# Altium project Multislope.PrjPcb (part 1 of 2)
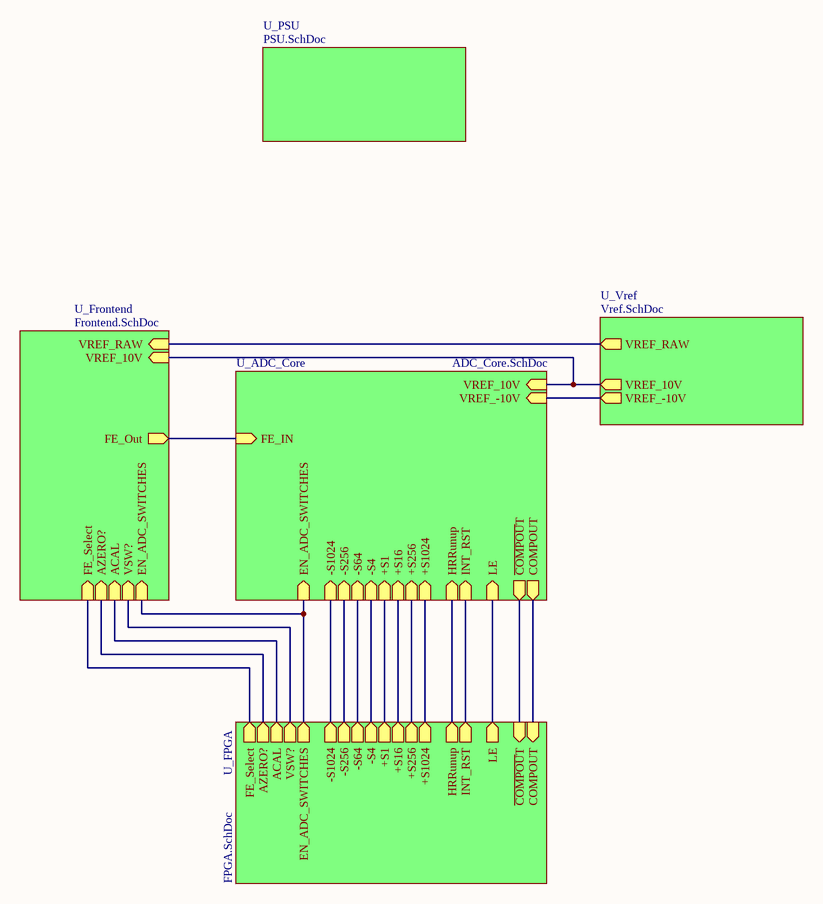
[diagram p0: Block_Diagram.SchDoc]
6 sheets, 139 parts. Net scope: hierarchical (ports join the sheet entries above them; power ports are global).
Board files: Multislope_Board.PcbDoc, MacLayout.PcbDoc, Copy of MacLayout.PcbDoc
Sheets:
  Block_Diagram.SchDoc
    U_ADC_Core = ADC_Core.SchDoc
    U_Vref = Vref.SchDoc
    U_Frontend = Frontend.SchDoc
    U_FPGA = FPGA.SchDoc
    U_PSU = PSU.SchDoc

## Sheet Block_Diagram.SchDoc
size A3

### Sub-sheets
U_ADC_Core = ADC_Core.SchDoc: FE_IN (in), -S64 (in), -S1024 (in), COMPOUT (out), +S16 (in), +S1024 (in), +S256 (in), LE (in), -S4 (in), INT_RST (in), ~{COMPOU}T (out), -S256 (in), HRRunup (in), +S1 (in), VREF_10V (in), VREF_-10V (in), EN_ADC_SWITCHES (in)
U_FPGA = FPGA.SchDoc: COMPOUT (in), ~{COMPOU}T (in), LE (out), INT_RST (out), HRRunup (out), +S1024 (out), +S256 (out), +S16 (out), +S1 (out), -S4 (out), -S64 (out), -S256 (out), -S1024 (out), EN_ADC_SWITCHES (out), VSW? (out), ACAL (out), AZERO? (out), FE_Select (out)
U_Frontend = Frontend.SchDoc: FE_Out (out), VREF_10V (in), VSW? (in), FE_Select (in), AZERO? (in), ACAL (in), VREF_RAW (in), EN_ADC_SWITCHES (in)
U_PSU = PSU.SchDoc: no entries
U_Vref = Vref.SchDoc: VREF_10V (out), VREF_-10V (out), VREF_RAW (out)

### Nets
SW_ENABLE: sheet U_ADC_Core/EN_ADC_SWITCHES, sheet U_Frontend/EN_ADC_SWITCHES, sheet U_FPGA/EN_ADC_SWITCHES
NetB1_CB_2: sheet U_ADC_Core/+S1024, sheet U_FPGA/+S1024
NetB1_CB_3: sheet U_ADC_Core/+S256, sheet U_FPGA/+S256
NetB1_CB_5: sheet U_ADC_Core/+S16, sheet U_FPGA/+S16
NetB1_CB_6: sheet U_ADC_Core/+S1, sheet U_FPGA/+S1
NetB1_CB_8: sheet U_ADC_Core/-S4, sheet U_FPGA/-S4
NetB1_CB_9: sheet U_ADC_Core/-S64, sheet U_FPGA/-S64
NetB1_CB_11: sheet U_ADC_Core/-S256, sheet U_FPGA/-S256
NetB1_CB_12: sheet U_ADC_Core/-S1024, sheet U_FPGA/-S1024
NetB1_CB_15: sheet U_Frontend/AZERO?, sheet U_FPGA/AZERO?
NetB1_CB_17: sheet U_Frontend/FE_Select, sheet U_FPGA/FE_Select
NetB1_CB_18: sheet U_ADC_Core/LE, sheet U_FPGA/LE
NetB1_CB_20: sheet U_Frontend/ACAL, sheet U_FPGA/ACAL
NetB1_CB_21: sheet U_Frontend/VSW?, sheet U_FPGA/VSW?
NetB1_CB_45: sheet U_ADC_Core/~{COMPOU}T, sheet U_FPGA/~{COMPOU}T
NetB1_CB_46: sheet U_ADC_Core/COMPOUT, sheet U_FPGA/COMPOUT
NetB1_CB_48: sheet U_ADC_Core/HRRunup, sheet U_FPGA/HRRunup
NetB1_CB_49: sheet U_ADC_Core/INT_RST, sheet U_FPGA/INT_RST
NetIC1_8: sheet U_ADC_Core/FE_IN, sheet U_Frontend/FE_Out
NetIC2_5: sheet U_Vref/VREF_RAW, sheet U_Frontend/VREF_RAW
NetL1_2: sheet U_ADC_Core/VREF_10V, sheet U_Vref/VREF_10V, sheet U_Frontend/VREF_10V
NetL3_1: sheet U_ADC_Core/VREF_-10V, sheet U_Vref/VREF_-10V

## Sheet ADC_Core.SchDoc
size A2
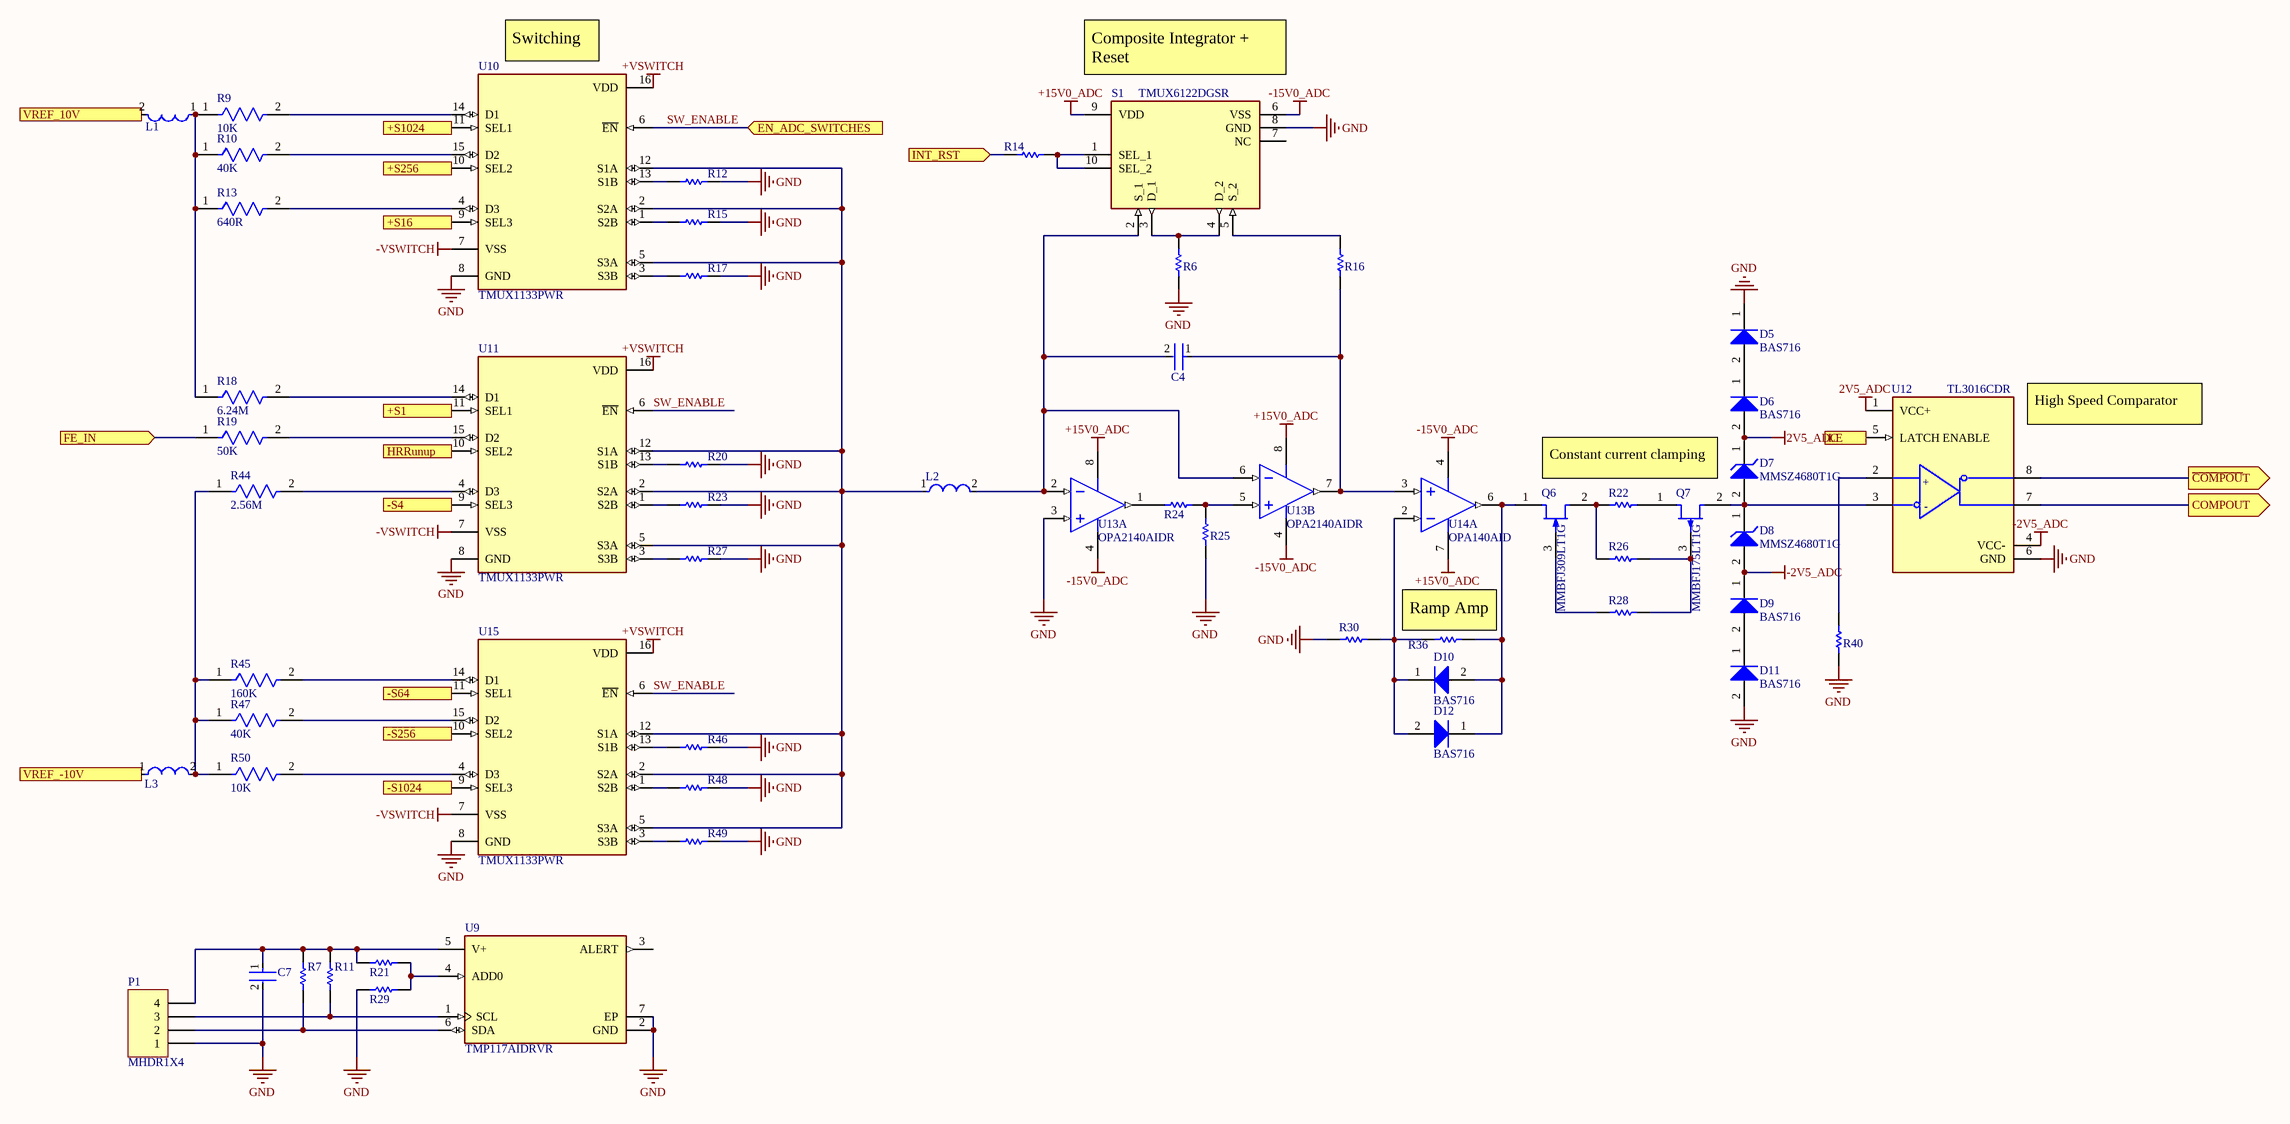
[diagram p1: ADC_Core.SchDoc]

### Parts
C4  C1206C331J5GACTU  [FP-C1206C-EB-MFG]  (value not drawn)
C7  C0402C104K8PACTU  [FP-C0402-BB-MFG]  (value not drawn)
D5  BAS716  [ONSC-SOD-523-2-502-01_V]
D6  BAS716  [ONSC-SOD-523-2-502-01_V]
D7  MMSZ4680T1G  [ONSC-SOD-123-2-425-04_V]
D8  MMSZ4680T1G  [ONSC-SOD-123-2-425-04_V]
D9  BAS716  [ONSC-SOD-523-2-502-01_V]
D10  BAS716  [ONSC-SOD-523-2-502-01_V]
D11  BAS716  [ONSC-SOD-523-2-502-01_V]
D12  BAS716  [ONSC-SOD-523-2-502-01_V]
L1  LQW15ANR10J00D  [FP-LQW15AN_00-W0_5-0_1-MFG]  (value not drawn)
L2  LQW15ANR10J00D  [FP-LQW15AN_00-W0_5-0_1-MFG]  (value not drawn)
L3  LQW15ANR10J00D  [FP-LQW15AN_00-W0_5-0_1-MFG]  (value not drawn)
P1  MHDR1X4  [MHDR1X4]
Q6  MMBFJ309LT1G  [ONSC-SOT-23-3-318-08_V]
Q7  MMBFJ175LT1G  [ONSC-SOT-23-3-318-08_V]
R6  ERJ-3GEYJ202V  [RESC1608X55X30ML15T15]  (value not drawn)
R7  CRCW04021K20FKED  [RESC1005X40X25NL05T05]  (value not drawn)
R9  10K  [FP-RC1206-MFG]
R10  40K  [FP-RC1206-MFG]
R11  CRCW04021K20FKED  [RESC1005X40X25NL05T05]  (value not drawn)
R12  ERJ-3GEYJ202V  [RESC1608X55X30ML15T15]  (value not drawn)
R13  640R  [FP-RC1206-MFG]
R14  ERJ-3GEYJ202V  [RESC1608X55X30ML15T15]  (value not drawn)
R15  ERJ-3GEYJ202V  [RESC1608X55X30ML15T15]  (value not drawn)
R16  ERJ-3GEYJ202V  [RESC1608X55X30ML15T15]  (value not drawn)
R17  ERJ-3GEYJ202V  [RESC1608X55X30ML15T15]  (value not drawn)
R18  6.24M  [FP-RC1206-MFG]
R19  50K  [FP-RC1206-MFG]
R20  ERJ-3GEYJ202V  [RESC1608X55X30ML15T15]  (value not drawn)
R21  CRCW04021K20FKED  [RESC1005X40X25NL05T05]  (value not drawn)
R22  ERJ-3GEYJ202V  [RESC1608X55X30ML15T15]  (value not drawn)
R23  ERJ-3GEYJ202V  [RESC1608X55X30ML15T15]  (value not drawn)
R24  ERJ-3GEYJ202V  [RESC1608X55X30ML15T15]  (value not drawn)
R25  ERJ-3GEYJ202V  [RESC1608X55X30ML15T15]  (value not drawn)
R26  ERJ-3EKF4220V  [RESC1608X55X30ML15T15]  (value not drawn)
R27  ERJ-3GEYJ202V  [RESC1608X55X30ML15T15]  (value not drawn)
R28  ERJ-3GEYJ202V  [RESC1608X55X30ML15T15]  (value not drawn)
R29  CRCW04021K20FKED  [RESC1005X40X25NL05T05]  (value not drawn)
R30  ERJ-3GEYJ202V  [RESC1608X55X30ML15T15]  (value not drawn)
R36  ERJ-3GEYJ202V  [RESC1608X55X30ML15T15]  (value not drawn)
R40  ERJ-3GEYJ202V  [RESC1608X55X30ML15T15]  (value not drawn)
R44  2.56M  [FP-RC1206-MFG]
R45  160K  [FP-RC1206-MFG]
R46  ERJ-3GEYJ202V  [RESC1608X55X30ML15T15]  (value not drawn)
R47  40K  [FP-RC1206-MFG]
R48  ERJ-3GEYJ202V  [RESC1608X55X30ML15T15]  (value not drawn)
R49  ERJ-3GEYJ202V  [RESC1608X55X30ML15T15]  (value not drawn)
R50  10K  [FP-RC1206-MFG]
S1  TMUX6122DGSR  [SOP50P490X110-10N]
U9  TMP117AIDRVR  [FP-DRV0006A-MFG]
U10  TMUX1133PWR  [FP-PW0016A-MFG]
U11  TMUX1133PWR  [FP-PW0016A-MFG]
U12  TL3016CDR  [FP-D0008A-IPC_A]
U13  OPA2140AIDR  [D0008A_M]  (parts A,B of 2)
U14  OPA140AID  [D0008A_M]  (part A of 2)
U15  TMUX1133PWR  [FP-PW0016A-MFG]

### Ports
+S1 (in), +S16 (in), +S256 (in), +S1024 (in), -S4 (in), -S64 (in), -S256 (in), -S1024 (in), COMPOUT (out), EN_ADC_SWITCHES (in), FE_IN (in), HRRunup (in), INT_RST (in), LE (in), VREF_10V (in), VREF_-10V (in), ~{COMPOU}T (out)

### Nets
2V5_ADC: D6.2(A) D7.1(K) U12.1(VCC+)
+15V0_ADC: S1.9(VDD) U13.8(V+) U14.7(V+)
+VSWITCH: U10.16(VDD) U11.16(VDD) U15.16(VDD)
-2V5_ADC: D8.2(A) D9.1(K) U12.4(VCC-)
-15V0_ADC: S1.6(VSS) U13.4(V-) U14.4(V-)
-VSWITCH: U10.7(VSS) U11.7(VSS) U15.7(VSS)
GND: C7.2 D5.1(K) D11.2(A) P1.1 R6.1 R12.2 R15.2 R17.2 R20.2 R23.2 R25.1 R27.2 R29.2 R30.1 R40.1 R46.2 R48.2 R49.2 S1.8(GND) U9.2(GND) U9.7(EP) U10.8(GND) U11.8(GND) U12.6(GND) U13.3(IN_A+) U15.8(GND)
SW_ENABLE: U10.6(~{EN}) U11.6(~{EN}) U15.6(~{EN}) ; port EN_ADC_SWITCHES
NetB1_CB_2: U10.11(SEL1) ; port +S1024
NetB1_CB_3: U10.10(SEL2) ; port +S256
NetB1_CB_5: U10.9(SEL3) ; port +S16
NetB1_CB_6: U11.11(SEL1) ; port +S1
NetB1_CB_8: U11.9(SEL3) ; port -S4
NetB1_CB_9: U15.11(SEL1) ; port -S64
NetB1_CB_11: U15.10(SEL2) ; port -S256
NetB1_CB_12: U15.9(SEL3) ; port -S1024
NetB1_CB_18: U12.5(LATCH_ENABLE) ; port LE
NetB1_CB_45: U12.8(~{Q_OUT}) ; port ~{COMPOU}T
NetB1_CB_46: U12.7(Q_OUT) ; port COMPOUT
NetB1_CB_48: U11.10(SEL2) ; port HRRunup
NetB1_CB_49: R14.2 ; port INT_RST
NetC4_1: C4.1 R16.1 U13.7(OUT_B) U14.3(IN+)
NetC4_2: C4.2 L2.2 S1.2(S_1) U13.2(IN_A-) U13.6(IN_B-)
NetC7_1: C7.1 P1.4 R7.2 R11.2 R21.2 U9.5(V+)
NetD5_2: D5.2(A) D6.1(K)
NetD7_2: D7.2(A) D8.1(K) Q7.2(S) U12.3(IN-)
NetD9_2: D9.2(A) D11.1(K)
NetD10_1: D10.1(K) D12.2(A) R30.2 R36.1 U14.2(IN-)
NetD10_2: D10.2(A) D12.1(K) Q6.1(D) R36.2 U14.6(OUT)
NetIC1_8: R19.1 ; port FE_IN
NetL1_1: L1.1 R9.1 R10.1 R13.1 R18.1
NetL1_2: L1.2 ; port VREF_10V
NetL2_1: L2.1 U10.2(S2A) U10.5(S3A) U10.12(S1A) U11.2(S2A) U11.5(S3A) U11.12(S1A) U15.2(S2A) U15.5(S3A) U15.12(S1A)
NetL3_1: L3.1 ; port VREF_-10V
NetL3_2: L3.2 R44.1 R45.1 R47.1 R50.1
NetP1_2: P1.2 R7.1 U9.6(SDA)
NetP1_3: P1.3 R11.1 U9.1(SCL)
NetQ6_2: Q6.2(S) R22.1 R26.1
NetQ6_3: Q6.3(G) R28.1
NetQ7_1: Q7.1(D) R22.2
NetQ7_3: Q7.3(G) R26.2 R28.2
NetR6_2: R6.2 S1.3(D_1) S1.4(D_2)
NetR9_2: R9.2 U10.14(D1)
NetR10_2: R10.2 U10.15(D2)
NetR12_1: R12.1 U10.13(S1B)
NetR13_2: R13.2 U10.4(D3)
NetR14_1: R14.1 S1.1(SEL_1) S1.10(SEL_2)
NetR15_1: R15.1 U10.1(S2B)
NetR16_2: R16.2 S1.5(S_2)
NetR17_1: R17.1 U10.3(S3B)
NetR18_2: R18.2 U11.14(D1)
NetR19_2: R19.2 U11.15(D2)
NetR20_1: R20.1 U11.13(S1B)
NetR21_1: R21.1 R29.1 U9.4(ADD0)
NetR23_1: R23.1 U11.1(S2B)
NetR24_1: R24.1 R25.2 U13.5(IN_B+)
NetR24_2: R24.2 U13.1(OUT_A)
NetR27_1: R27.1 U11.3(S3B)
NetR40_2: R40.2 U12.2(IN+)
NetR44_2: R44.2 U11.4(D3)
NetR45_2: R45.2 U15.14(D1)
NetR46_1: R46.1 U15.13(S1B)
NetR47_2: R47.2 U15.15(D2)
NetR48_1: R48.1 U15.1(S2B)
NetR49_1: R49.1 U15.3(S3B)
NetR50_2: R50.2 U15.4(D3)

Not connected (* = marked no-connect by the designer): S1 7(NC); U9 3(ALERT)

### Notes on the sheet
- (near U10) Switching
- (near S1) Composite Integrator + Reset
- (near U12) High Speed Comparator
- Constant current clamping
- (near R36) Ramp Amp
- (in symbol CMP-04896-000132-1) +

### Library data of the parts
C4 = CMP-03020-027730-1: CAP CER 330PF 50V 5% NP0 1206; Manufacturer: KEMET; Temperature Characteristic: C0G; Tolerance: 0.05; Material: Ceramic; Automotive Grade: Grade 0; Temperature Coefficient: 15%; Value: 330 pF; Capacitance: 330 pF; Voltage Rating: 50 V; Category: Cap; ComponentLink2Description: Datasheet; Octopart: https://octopart.com/c1206c331j5gactu-kemet-3859988; Lead Free: Yes; Automotive: Yes; ComponentLink2URL: https://content.kemet.com/datasheets/KEM_C1007_X8R_ULTRA_150C_SMD.pdf; Device Class L2: Capacitors; Digikey Description: CAP CER 330PF 50V 5% NP0 1206; Mouser Description: Multilayer Ceramic Capacitors MLCC - SMD/SMT 50volts 330pF C0G 5%; Manufacturer Part Number: C1206C331J5GACTU; Temperature Range High: +150°C; Package: C1206C-EB; Height: 0.88mm; Ipc Land Pattern Name: CAPC320160X78; Temperature Range Low: -55°C; Device Class L3: Ceramic Capacitors; Temperature: -55°C to +150°C; Device Class L1: Passive Components; RoHS: TRUE
C7 = CMP-2008-02046-2: CAP CER 0.1UF 10V X5R 0402; Manufacturer: Kemet; Material: Ceramic; Capacitance: 0.10 μF; Temperature Coefficient: 15%; Description: C0402 0.10 μF X5R 10.00% 10 V; Tolerance: 0.1; Value: 0.10 μF; Package: C0402-BB; Temperature: -55°C to +125°C; ComponentLink2Description: Datasheet; Temperature Characteristic: X5R; Device Class L1: Passive Components; Height: 0.55mm; Lead Free: Yes; ComponentLink2URL: https://content.kemet.com/datasheets/KEM_C1002_X7R_SMD.pdf; Device Class L2: Capacitors; Temperature Range Low: -55°C; Temperature Range High: +125°C; RoHS: TRUE; Octopart: https://octopart.com/c0402c104k8pactu-kemet-140039; Automotive: No; Mouser Description: Capacitor 100 nF 10 VDC 0402; Category: Cap; Voltage Rating: 10 V; Digikey Description: CAP CER 0.1UF 10V X5R 0402; Ipc Land Pattern Name: CAPC10050X50; Device Class L3: Ceramic Capacitors; Manufacturer Part Number: C0402C104K8PACTU
D5 D6 D9-D12 = CMP-1055-00490-1: Schottky Barrier Diode, 2-Pin SOD-523, Pb-Free, Tape and Reel; PartNumber: BAT54XV2T5G; Manufacturer: On Semiconductor; IFSM Max (A): 0.6; trr Max (ns): 5; Configuration: Single; PackageDescription: 2-Pin SOD, Body 1.2 x 0.8 mm; PackageReference: SOD-523-2-502-01; DatasheetVersion: Rev. 8; Packing: Tape and Reel; PackageVersion: Rev. E, 09/2010; ComponentLink2Description: Datasheet; ComponentLink3URL: http://www.onsemi.com/pub_link/Collateral/502-01.PDF; RoHS: TRUE; ComponentLink2URL: http://www.onsemi.cn/pub_link/Collateral/BAT54XV2T1-D.PDF; ComponentLink1Description: Manufacturer URL; Mounting Technology: Surface Mount; ComponentLink3Description: Package Specification; ComponentLink1URL: http://www.onsemi.com/
D7 D8 = CMP-1060-00604-1: Zener Voltage Regulator, 500 mW, 2-Pin SOD-123, Pb-Free, Tape and Reel; Manufacturer: On Semiconductor; P Max (W): 0.5; VZ Typ (V): 2.2; DatasheetVersion: Rev. 9; PackageReference: SOD-123-2-425-04; PackageDescription: 2-Pin SOD, Body 1.6 x 2.69 mm; ComponentLink3URL: http://www.onsemi.com/pub_link/Collateral/425-04.PDF; ComponentLink1Description: Manufacturer URL; ComponentLink1URL: http://www.onsemi.com/; ComponentLink3Description: Package Specification; PackageVersion: Rev. G, 10/2009; Packing: Tape and Reel; PartNumber: MMSZ4680T1G; ComponentLink2Description: Datasheet; RoHS: Pb-Free; ComponentLink2URL: http://www.onsemi.com/pub_link/Collateral/MMSZ4678T1-D.PDF; Mounting Technology: Surface Mount
L1-L3 = CMP-06042-005024-1: Wire Wound RF Inductor 100nH ±5% 120mA 2.52Ω 0402 (1005); DC Resistance (DCR): 2.52R; Core Material: Air; Test Frequency: 100MHz; Self Resonant Frequency: 1.5GHz; Shielding: Unshielded; Length: 1mm; Radiation Hardening: No; REACH SVHC: No SVHC; Case Code (Metric): 1005; Inductance Tolerance: 5%; Weight: 2.8E-05oz; Case/Package: 0402; Mount: Surface Mount; Number of Pins: 2; Height: 0.5mm; Max DC Current: 120mA; Max Operating Temperature: 125°C; Termination: SMD/SMT; Min Operating Temperature: -55°C; DC Current: 120mA; Depth: 0.6mm; Current Rating: 120mA; Tolerance: 5%; Inductance: 100nH; Package Quantity: 10000; Lead Free: Lead Free; Case Code (Imperial): 0402; Packaging: Tape and Reel; Width: 0.5mm; Military Standard: Not
P1 = MHDR1X4: Header, 4-Pin; LatestRevisionDate: 17-Jul-2002; LatestRevisionNote: Re-released for DXP Platform.; Publisher: Altium Limited
Q6 = CMP-1062-00028-1: JFET - VHF / UHF Amplifier Transistor, N-Channel, 3-Pin SOT-23, Pb-Free, Tape and Reel; Manufacturer: On Semiconductor; IDSS Max (uA): 30000; Ciss Max (pF): 5; Crss Max (pF): 2.5; IDSS Min (uA): 12000; V(BR)GSS Min (V): 25; Channel Polarity: N Channel; DatasheetVersion: Rev. 7; RoHS: Pb-Free; ComponentLink2URL: http://www.onsemi.cn/pub_link/Collateral/MMBFJ309LT1-D.PDF; ComponentLink3Description: Package Specification; Packing: Tape and Reel; Mounting Technology: Surface Mount; PartNumber: MMBFJ309LT1G; PackageReference: SOT-23-3-318-08; PackageVersion: Rev. AP, 11/2009; ComponentLink1URL: http://www.onsemi.com/; ComponentLink3URL: http://www.onsemi.cn/pub_link/Collateral/318-08.PDF; ComponentLink1Description: Manufacturer URL; PackageDescription: 3-Pin Small Outline Transistor, Body 2.92 x 1.3 mm, Pitch 0.95 mm; ComponentLink2Description: Datasheet
Q7 = CMP-1062-00050-1: JFET Chopper, P-Channel - Depletion, 3-Pin SOT-23, Pb-Free, Tape and Reel; Manufacturer: On Semiconductor; IDSS Min (uA): 7000; Channel Polarity: P Channel; Ciss Max (pF): 11; V(BR)GSS Min (V): 30; IDSS Max (uA): 60000; Crss Max (pF): 5.5; PackageVersion: Rev. AP, 11/2009; DatasheetVersion: Rev. 5; ComponentLink1Description: Manufacturer URL; ComponentLink1URL: http://www.onsemi.com/; ComponentLink2URL: http://www.onsemi.com/pub_link/Collateral/MMBFJ175LT1-D.PDF; PartNumber: MMBFJ175LT1G; PackageDescription: 3-Pin Small Outline Transistor, Body 2.92 x 1.3 mm, Pitch 0.95 mm; RoHS: Pb-Free; ComponentLink3URL: http://www.onsemi.cn/pub_link/Collateral/318-08.PDF; ComponentLink2Description: Datasheet; Packing: Tape and Reel; Mounting Technology: Surface Mount; ComponentLink3Description: Package Specification; PackageReference: SOT-23-3-318-08
R6 R12 R14-R17 R20 R22-R25 R27 R28 R30 R36 R40 R46 R48 R49 = CMP-2000-00741-1: Manufacturer: Panasonic; Part Number: ERJ-3GEYJ202V
R7 R11 R21 R29 = CMP-2002-08284-1: Manufacturer: Vishay Dale; Part Number: CRCW04021K20FKED
R9 R10 R13 R18 R19 R44 R45 R47 R50 = CMP-2100-03681-2: RES SMD 0 OHM JUMPER 1/4W 1206; Manufacturer Part Number: RC1206JR-070RL; Manufacturer: YAGEO; Voltage Rating: 200V; Temperature Coefficient: 300ppm/°C; Power Rating: 0.25W; Value: 0Ω; Tolerance: 5%; Temperature Range Low: -55°C; Category: Res; Automotive: No; Ipc Land Pattern Name: RESC310160X55; Device Class L1: Passive Components; Temperature: -55°C to +155°C; ComponentLink2URL: https://www.yageo.com/upload/media/product/productsearch/datasheet/rchip/PYu-RC_Group_51_RoHS_L_10.pdf; Lead Free: Yes; Height: 0.65mm; Footprint Url: https://www.yageo.com/upload/website/yageo_PYu-R_Mount_10_19050818_343.pdf; Package: RC1206; Digikey Description: RES SMD 0 OHM JUMPER 1/4W 1206; Temperature Range High: +155°C; Device Class L3: Chip SMD Resistors; Device Class L2: Resistors; Octopart: https://octopart.com/rc1206jr-070rl-yageo-40025601; Resistance: 0Ω; Series: RC; ComponentLink2Description: Datasheet; Composition: Thick Film; RoHS: TRUE; Mouser Description: Resistor: thick film; SMD; 1206; 0O; 0.25W; ±5%; -55÷155°C
R26 = CMP-2000-00493-1: Manufacturer: Panasonic; Part Number: ERJ-3EKF4220V
S1 = TMUX6122DGSR: Switch; Manufacturer_Name: Texas Instruments; Datasheet Link: http://www.ti.com/lit/gpn/TMUX6122; Height: 1.1mm; Manufacturer_Part_Number: TMUX6122DGSR; Mouser Part Number: 595-TMUX6122DGSR; Mouser Price/Stock: https://www.mouser.co.uk/ProductDetail/Texas-Instruments/TMUX6122DGSR?qs=l7cgNqFNU1g7U5Em%252B8JhAQ%3D%3D; Arrow Part Number: TMUX6122DGSR; Arrow Price/Stock: https://www.arrow.com/en/products/tmux6122dgsr/texas-instruments
U9 = CMP-04948-000009-1: TEMPERATURE SENSOR; Manufacturer: Texas Instruments; Operating Supply Current: 3.5-16uA; Standoff Height: 0mm; Min Supply Voltage: 1.8V; Resolution: 16bits; Description: Temperature Sensor Digital, Local -55°C ~ 150°C 16 b 6-WSON (2x2); Interface: I2C,2-Wire,SMBus; Max Junction Temp: +150°C; Max Supply Voltage: 5.5V; Octopart: https://octopart.com/tmp117aidrvr-texas+instruments-95511044; Lead Free: Yes; ComponentLink2Description: Datasheet; Temperature Range High: +150°C; Manufacturer Part Number: TMP117AIDRVR; Ambient Temperature Range High: +150°C; Ambient Temperature Range Low: -55°C; Height: 0.8mm; ComponentLink2URL: http://www.ti.com/lit/ds/symlink/tmp117.pdf; Automotive: No; Device Class L1: Sensors; RoHS: TRUE; Package: DRV0006A; Device Class L3: unset; Temperature: -55°C to +150°C; Temperature Range Low: -55°C; Ipc Land Pattern Name: DFN200X200X80-6; Device Class L2: Temperature and Humidity Sensors; Category: IC; Digikey Description: TEMPERATURE SENSOR
U10 U11 U15 = CMP-04892-000026-1: IC SWITCH
U12 = CMP-04896-000132-1: IC PREC COMP ULTRA-FAST 8-SOIC; Power Dissipation: 725mW; Dual Supply Voltage: 5V; Nominal Supply Current: 10.6mA; Max Supply Voltage: 10V; Common Mode Rejection Ratio: 97dB; Output Type: TTL; Response Time: 0.0078us; Max Input Current: 10uA; Power Supply Rejection Ratio (PSRR): 72dB; Number of Elements: 1; Output Current: 20mA; Propagation Delay: 10ns; Quiescent Current: 12.5mA; Input Offset Voltage (Vos): 3mV; Min Operating Temperature: -40°C; Series: -; Length: 4.9mm; Width: 3.91mm; Radiation Hardening: No; Height: 1.58mm; Number of Pins: 8; Supply Current: 10.6mA; Max Operating Temperature: 85°C; Weight: 0.002561oz; Technology: BICMOS; Mount: Surface Mount; Min Supply Voltage: 5V; Package Quantity: 2500; Number of Channels: 1; Case/Package: SOIC; RoHS Compliant: Yes; Max Supply Current: 12.5mA; Lead Free: Lead Free; Max Power Dissipation: 725mW; Packaging: Tape and Reel; Input Bias Current: 10uA
U13 = CMP-0272-00256-3: 11 MHz, Precision, Low Noise, Rail-to-Rail Output, JFET Operational Amplifier, 4.5 to 36 V, -40 to 125 degC, 8-pin SOIC (D8), Green (RoHS & no Sb/Br); Manufacturer: Texas Instruments; Number of Channels: 2; Total Supply Voltage(Min)(+5V is 5, +/-5V is 10): 4.5; Vio (25C)(Max)(mV): 0.12; Total Supply Voltage(Max)(+5V is 5, +/-5V is 10): 36; Offset Drift(Typ)(uV/C): 0.35; IIB(Max)(pA): 10; GBW(Typ)(MHz): 11; Slew Rate(Typ)(V/us): 20; Packing: LARGE T&R; Sub Family: High Supply Voltage Amplifier (>=30V), Low Input Bias Current Amp (<=10pA), Low Noise Amp (<=10nV/rtHz), Low Offset Voltage Amplifier (<=500uV), Precision Amplifier; CMRR(Min)(dB): 126; Rating: Catalog; PackageReference: D0008A; ComponentLink2URL: http://www.ti.com/lit/ds/symlink/opa2140.pdf; ComponentLink1Description: Manufacturer URL; Iq per channel(Max)(mA): 2; Code_JEDEC: MS-012; PartNumber: OPA2140AIDR; Eco-Plan: Green (RoHS & no Sb/Br); ComponentLink3URL: http://www.ti.com/litv/pdf/msoi002j; ComponentLink3Description: Package Specification; ComponentLink1URL: http://www.ti.com/; DatasheetVersion: SBOS498A; PackageVersion: 4040047-3/M, 06/2011; Mounting Technology: Surface Mount; ComponentLink2Description: Datasheet; PackageDescription: 8-Pin Plastic Small Outline, Body 4.9 x 3.9 mm, Pitch 1.27 mm
U14 = CMP-0271-00131-3: 11 MHz, Single Supply, Low Noise, Precision, Rail-to-Rail Output, JFET Amplifier, 4.5 to 36 V, -40 to 125 degC, 8-pin SOIC (D8), Green (RoHS & no Sb/Br); Manufacturer: Texas Instruments; Vio (25C)(Max)(mV): 0.12; Number of Channels: 1; Packing: TUBE; Rating: Catalog; Offset Drift(Typ)(uV/C): 0.35; Sub Family: High Supply Voltage Amplifier (>=30V), Low Input Bias Current Amp (<=10pA), Low Noise Amp (<=10nV/rtHz), Low Offset Voltage Amplifier (<=500uV), Precision Amplifier; Total Supply Voltage(Min)(+5V is 5, +/-5V is 10): 4.5; Iq per channel(Max)(mA): 2; Total Supply Voltage(Max)(+5V is 5, +/-5V is 10): 36; IIB(Max)(pA): 10; GBW(Typ)(MHz): 11; CMRR(Min)(dB): 126; Slew Rate(Typ)(V/us): 20; PackageDescription: 8-Pin Plastic Small Outline, Body 4.9 x 3.9 mm, Pitch 1.27 mm; PackageReference: D0008A; ComponentLink3Description: Package Specification; ComponentLink3URL: http://www.ti.com/litv/pdf/msoi002j; DatasheetVersion: SBOS498A; Mounting Technology: Surface Mount; ComponentLink2Description: Datasheet; ComponentLink2URL: http://www.ti.com/lit/ds/symlink/opa140.pdf; ComponentLink1Description: Manufacturer URL; ComponentLink1URL: http://www.ti.com/; PackageVersion: 4040047-3/M, 06/2011; Code_JEDEC: MS-012; Eco-Plan: Green (RoHS & no Sb/Br); PartNumber: OPA140AID

## Sheet Vref.SchDoc
size A2
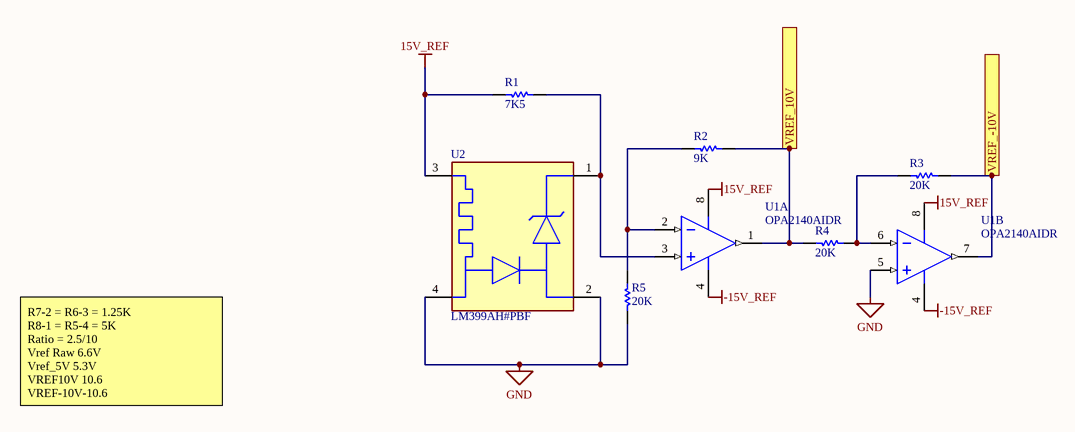
[diagram p2: Vref.SchDoc]

### Parts
R1  7K5  [RESC2013X60X35ML10T20]
R2  9K  [RESC2013X60X35ML10T20]
R3  20K  [RESC2013X60X35ML10T20]
R4  20K  [RESC2013X60X35ML10T20]
R5  20K  [RESC2013X60X35ML10T20]
U1  OPA2140AIDR  [D0008A_M]  (parts A,B of 2)
U2  LM399AH#PBF  [FP-H-4-05-08-1341-MFG]

### Ports
VREF_10V (out), VREF_-10V (out)

### Nets
15V_REF: R1.2 U1.8(V+) U2.3
-15V_REF: U1.4(V-)
GND: R5.2 U1.5(IN_B+) U2.2 U2.4
NetL1_2: R2.2 R4.1 U1.1(OUT_A) ; port VREF_10V
NetL3_1: R3.2 U1.7(OUT_B) ; port VREF_-10V
NetR1_1: R1.1 U1.3(IN_A+) U2.1
NetR2_1: R2.1 R5.1 U1.2(IN_A-)
NetR3_1: R3.1 R4.2 U1.6(IN_B-)

### Notes on the sheet
- R7-2 = R6-3 = 1.25K
  R8-1 = R5-4 = 5K
  Ratio = 2.5/10
  Vref Raw 6.6V
  Vref_5V 5.3V
  VREF10V 10.6
  VREF-10V-10.6

### Library data of the parts
R1-R5 = CMP-2100-03671-1: Chip Resistor, 1 KOhm, +/- 1%, 125 mW, -55 to 155 degC, 0805 (2012 Metric), RoHS, Tape and Reel; Manufacturer: Yageo; Temperature Coefficient: 100ppm/degreesC; Voltage Rating (DC): 150V; Max Power Dissipation: 125mW; Resistance: 1KOhm; Number of Pins: 2; Number of Terminations: 2; Datasheet URL: http://www.yageo.com/NewPortal/yageodocoutput?fileName=/pdf/R-Chip/PYu-RC_Group_51_RoHS_L_5.pdf; Length: 0.079inch; Package Description: 2-Pin Surface Mounted Device, Body 2 x 1.25 mm; Depth: 1.25mm; Height: 0.024inch; Military Standard: Not; Case/Package: 0805; Package Reference: 0805; RoHSCompliant: true; Lead Free: LeadFree; Packaging: TapeandReel; Package Quantity: 1; Datasheet Version: Rev. 5, 10/2016; Tolerance: 1%; Min Operating Temperature: -55degC; Voltage Rating: 150V; Composition: ThickFilm; Case Code (Imperial): 0805; Power Rating: 125mW; Width: 0.049inch; Case Code (Metric): 2012; Manufacturer URL: http://www.yageo.com/; Max Operating Temperature: 155degC; REACH SVHC: Unknown; Termination: SMD/SMT
U1 = CMP-0272-00256-3: as U13 on sheet ADC_Core; PackageReference: D0008A; ComponentLink2URL: http://www.ti.com/lit/ds/symlink/opa2140.pdf; ComponentLink1Description: Manufacturer URL; Iq per channel(Max)(mA): 2; Code_JEDEC: MS-012; PartNumber: OPA2140AIDR; Eco-Plan: Green (RoHS & no Sb/Br); ComponentLink3URL: http://www.ti.com/litv/pdf/msoi002j; ComponentLink3Description: Package Specification; ComponentLink1URL: http://www.ti.com/; DatasheetVersion: SBOS498A; PackageVersion: 4040047-3/M, 06/2011; Mounting Technology: Surface Mount; ComponentLink2Description: Datasheet; PackageDescription: 8-Pin Plastic Small Outline, Body 4.9 x 3.9 mm, Pitch 1.27 mm
U2 = CMP-09137-000115-1: IC VREF SHUNT 0.17% TO46-4; Max Output Voltage: 6.95V; Temperature Coefficient: 1ppm/°C; Cathode Current: 500uA; Output Current: 10mA; Number of Channels: 1; Tolerance: 2%; Min Operating Temperature: 0°C; Case/Package: TO-46; Package Quantity: 20; Reference Type: Shunt; Output Voltage: 6.95V; Max Operating Temperature: 70°C; Number of Pins: 4; Mount: Through Hole; Radiation Hardening: No; RoHS Compliant: Yes; Packaging: Rail/Tube

## Sheet Frontend.SchDoc
size A2
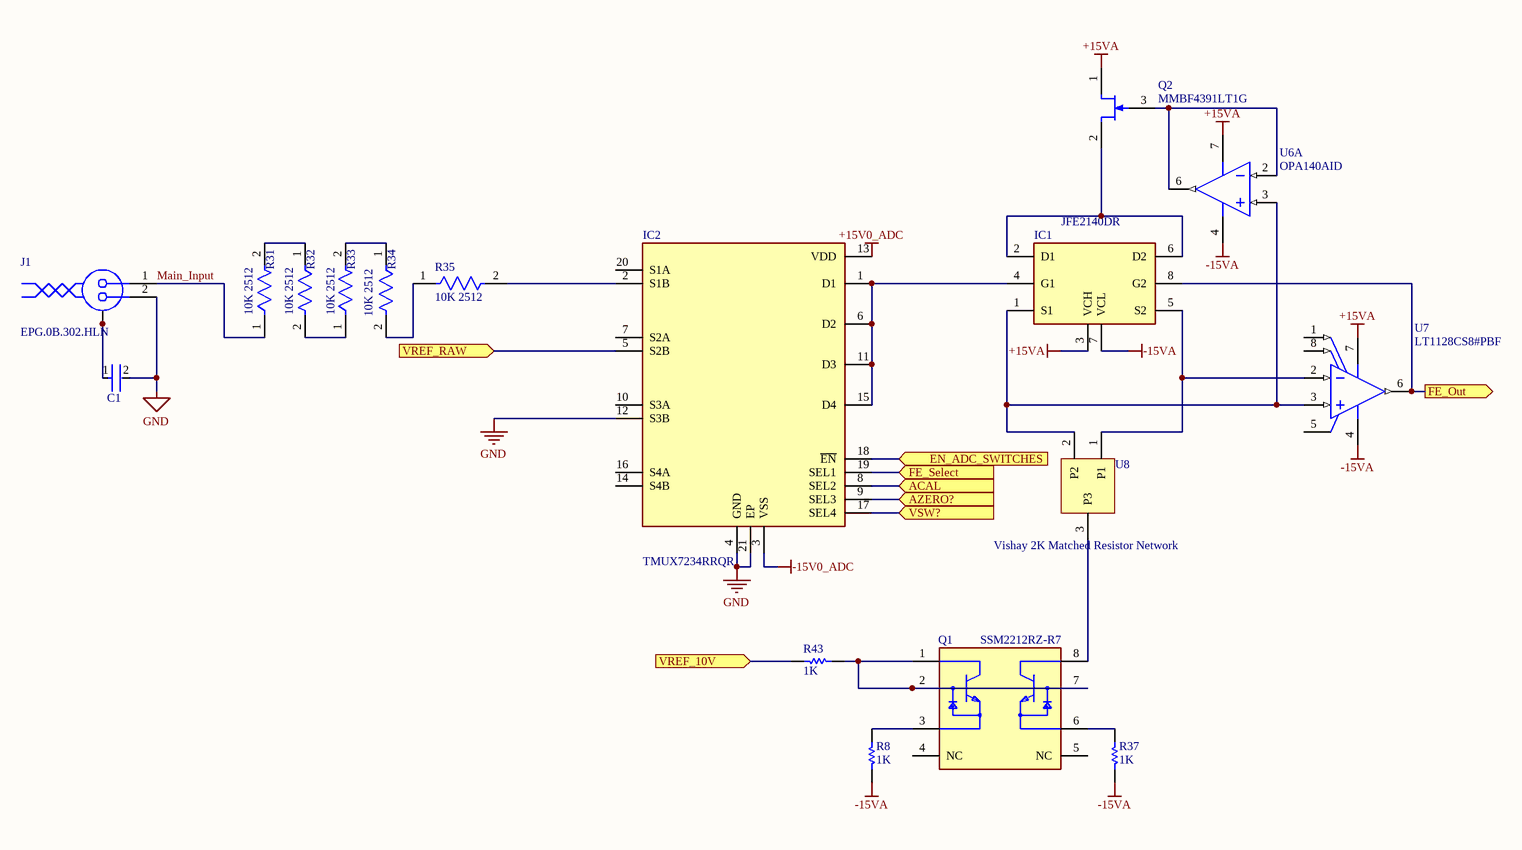
[diagram p3: Frontend.SchDoc]

### Parts
C1  CGA3E2X7R1H104K080AA  [FP-CGA3E-0_3-0_1-IPC_A]  (value not drawn)
IC1  JFE2140DR  [SOIC127P600X175-8N]
IC2  TMUX7234RRQR  [QFN50P400X400X80-21N-D]
J1  EPG.0B.302.HLN  [EPG.0B.302.HLN]
Q1  SSM2212RZ-R7  [FP-R-8-IPC_C]
Q2  MMBF4391LT1G  [ONSC-SOT-23-3-318-08_V]
R8  1K  [RESC2013X60X35ML10T20]
R31  10K 2512  [FP-CRCW2512-e3-MFG]
R32  10K 2512  [FP-CRCW2512-e3-MFG]
R33  10K 2512  [FP-CRCW2512-e3-MFG]
R34  10K 2512  [FP-CRCW2512-e3-MFG]
R35  10K 2512  [FP-CRCW2512-e3-MFG]
R37  1K  [RESC2013X60X35ML10T20]
R43  1K  [RESC2013X60X35ML10T20]
U6  OPA140AID  [D0008A_M]  (part A of 2)
U7  LT1128CS8#PBF  [LT-S8-8_M]
U8  Vishay 2K Matched Resistor Network  [MAXM-U3+2_L]

### Ports
ACAL (in), AZERO? (in), EN_ADC_SWITCHES (in), FE_Out (out), FE_Select (in), VREF_10V (in), VREF_RAW (in), VSW? (in)

### Nets
+15V0_ADC: IC2.13(VDD)
+15VA: IC1.3(VCH) Q2.1(D) U6.7(V+) U7.7(V+)
-15V0_ADC: IC2.3(VSS)
-15VA: IC1.7(VCL) R8.1 R37.1 U6.4(V-) U7.4(V-)
GND: C1.2 IC2.4(GND) IC2.12(S3B) IC2.21(EP) J1.2
Main_Input: J1.1 R31.1
SW_ENABLE: IC2.18(~{EN}) ; port EN_ADC_SWITCHES
NetB1_CB_15: IC2.9(SEL3) ; port AZERO?
NetB1_CB_17: IC2.19(SEL1) ; port FE_Select
NetB1_CB_20: IC2.8(SEL2) ; port ACAL
NetB1_CB_21: IC2.17(SEL4) ; port VSW?
NetC1_1: C1.1 J1.4 J1.5 J1.6 J1.7
NetIC1_1: IC1.1(S1) U6.3(IN+) U7.3(+IN) U8.2(P2)
NetIC1_2: IC1.2(D1) IC1.6(D2) Q2.2(S)
NetIC1_4: IC1.4(G1) IC2.1(D1) IC2.6(D2) IC2.11(D3) IC2.15(D4)
NetIC1_5: IC1.5(S2) U7.2(-IN) U8.1(P1)
NetIC1_8: IC1.8(G2) U7.6(OUT) ; port FE_Out
NetIC2_2: IC2.2(S1B) R35.2
NetIC2_5: IC2.5(S2B) ; port VREF_RAW
NetL1_2: R43.1 ; port VREF_10V
NetQ1_1: Q1.1(C1) Q1.2(B1) Q1.7(B2) R43.2
NetQ1_3: Q1.3(E1) R8.2
NetQ1_6: Q1.6(E2) R37.2
NetQ1_8: Q1.8(C2) U8.3(P3)
NetQ2_3: Q2.3(G) U6.2(IN-) U6.6(OUT)
NetR31_2: R31.2 R32.1
NetR32_2: R32.2 R33.1
NetR33_2: R33.2 R34.1
NetR34_2: R34.2 R35.1

Not connected (* = marked no-connect by the designer): IC2 7(S2A) 10(S3A) 14(S4B) 16(S4A) 20(S1A); Q1 4(NC) 5(NC); U7 1(VOS_TRIM) 5(OVERCOMP) 8(VOS_TRIM)

### Library data of the parts
C1 = CMP-2000-07546-2: Cap Ceramic 100nF 50V X7R 10% Pad SMD 0603 +125°C Automotive T/R; Weight: 7.1E-05oz; Composition: Ceramic; Max Operating Temperature: 125°C; Termination: SMD/SMT; Dielectric: X7R; Length: 1.6mm; Package Quantity: 1; REACH SVHC: No SVHC; Lead Free: Lead Free; Case Code (Metric): 1608; Min Operating Temperature: -55°C; Packaging: Tape and Reel; Tolerance: 10%; Voltage Rating: 50V; Case Code (Imperial): 0603; Capacitance: 100nF; Case/Package: 0603; Voltage Rating (DC): 50V; Depth: 0.8mm; Radiation Hardening: No; Ratings: AEC-Q200; Mount: Surface Mount; Voltage: 50V; Thickness: 0.035inch; Width: 0.8mm; Height: 0.8mm
IC1 = JFE2140DR: Integrated Circuit; Manufacturer_Name: Texas Instruments; Datasheet Link: https://www.ti.com/lit/ds/symlink/jfe2140.pdf?ts=1633964558921; Height: 1.75mm; Manufacturer_Part_Number: JFE2140DR; Mouser Part Number: 595-JFE2140DR; Mouser Price/Stock: https://www.mouser.co.uk/ProductDetail/Texas-Instruments/JFE2140DR?qs=A6eO%252BMLsxmQVeRIGZCabaw%3D%3D
IC2 = TMUX7234RRQR: Integrated Circuit; Manufacturer_Name: Texas Instruments; Datasheet Link: https://www.ti.com/lit/gpn/tmux7234; Height: 0.8mm; Manufacturer_Part_Number: TMUX7234RRQR; Mouser Part Number: 595-TMUX7234RRQR; Mouser Price/Stock: https://www.mouser.co.uk/ProductDetail/Texas-Instruments/TMUX7234RRQR?qs=pBJMDPsKWf2ane92Zx3aRA%3D%3D
J1 = CMP-1505-00295-1: Elbow receptacle for printed circuit (solder or screw fixing), Key (G), 0B series, Multipole Type with 2 Contacts; Manufacturer: LEMO; Contact Diameter: 0.9 mm; Rated Current(A): 6; Number of contacts: 2; AWG: 22; ComponentLink1URL: http://www.lemo.com; ComponentLink1Description: Manufacturer URL; DatasheetVersion: Jun-14; PackageReference: EPG.0B.302.HLN; ComponentLink2URL: http://intra.lemo.ch/catalog/ROW/UK_English/unipole_multipole.pdf; PartNumber: EPG.0B.302.HLN; ComponentLink2Description: Datasheet; PackageDescription: Elbow receptacle for printed circuit (solder or screw fixing), Key(G) for Printed Circuit
Q1 = CMP-09180-000002-1: TRANS 2NPN 40V 0.02A 8SOIC; Transition Frequency: 450MHz; Max Power Dissipation: 500mW; Element Configuration: Dual; Max Collector Current: 20mA; Polarity: NPN; Collector Emitter Breakdown Voltage: 45V; Number of Elements: 2; Collector-emitter Voltage-Max: 800mV; Frequency: 200MHz; Packaging: Tape and Reel; RoHS Compliant: Yes; Lead Free: Contains Lead; Contact Plating: Tin; Collector Emitter Voltage (VCEO): 40V; Max Breakdown Voltage: 40V; Case/Package: SOIC; Series: SSM2212; Radiation Hardening: No; Package Quantity: 1000; Number of Pins: 8; Collector Base Voltage (VCBO): 40V; Mount: Surface Mount; Max Operating Temperature: 85°C; Min Operating Temperature: -40°C
Q2 = CMP-1062-00030-1: JFET Switching Transistor, N-Channel, 3-Pin SOT-23, Pb-Free, Tape and Reel; Manufacturer: On Semiconductor; IDSS Min (uA): 50000; IDSS Max (uA): 150000; Crss Max (pF): 3.5; Ciss Max (pF): 14; V(BR)GSS Min (V): 30; Channel Polarity: N Channel; ComponentLink2URL: http://www.onsemi.com/pub_link/Collateral/MMBF4391LT1-D.PDF; PartNumber: MMBF4391LT1G; ComponentLink1URL: http://www.onsemi.com/; PackageDescription: 3-Pin Small Outline Transistor, Body 2.92 x 1.3 mm, Pitch 0.95 mm; DatasheetVersion: Rev. 10; PackageVersion: Rev. AP, 11/2009; ComponentLink2Description: Datasheet; Packing: Tape and Reel; ComponentLink1Description: Manufacturer URL; PackageReference: SOT-23-3-318-08; RoHS: Pb-Free; ComponentLink3Description: Package Specification; ComponentLink3URL: http://www.onsemi.cn/pub_link/Collateral/318-08.PDF; Mounting Technology: Surface Mount
R8 R37 R43 = CMP-2100-03671-1: as R1 on sheet Vref; Number of Pins: 2; Number of Terminations: 2; Datasheet URL: http://www.yageo.com/NewPortal/yageodocoutput?fileName=/pdf/R-Chip/PYu-RC_Group_51_RoHS_L_5.pdf; Length: 0.079inch; Package Description: 2-Pin Surface Mounted Device, Body 2 x 1.25 mm; Depth: 1.25mm; Height: 0.024inch; Military Standard: Not; Case/Package: 0805; Package Reference: 0805; RoHSCompliant: true; Lead Free: LeadFree; Packaging: TapeandReel; Package Quantity: 1; Datasheet Version: Rev. 5, 10/2016; Tolerance: 1%; Min Operating Temperature: -55degC; Voltage Rating: 150V; Composition: ThickFilm; Case Code (Imperial): 0805; Power Rating: 125mW; Width: 0.049inch; Case Code (Metric): 2012; Manufacturer URL: http://www.yageo.com/; Max Operating Temperature: 155degC; REACH SVHC: Unknown; Termination: SMD/SMT
R31-R35 = CMP-02407-004199-1: RES Thick Film, 100kΩ, 1%, 1W, 100ppm/°C, 2512; Voltage Rating: 500V; Resistance: 100kR; Case Code (Metric): 6432; Temperature Coefficient: 100ppm/°C; Weight: 0.001429oz; Radiation Hardening: No; Voltage Rating (DC): 500V; Case Code (Imperial): 2512; Length: 6.3mm; Number of Pins: 2; Military Standard: Not; Packaging: Tape and Reel; Contact Plating: Tin; Width: 3.15mm; Lead Free: Lead Free; Package Quantity: 2000; Composition: Thick Film; Termination: SMD/SMT; Number of Terminations: 2; Features: Automotive AEC-Q200; Max Power Dissipation: 1W; Case/Package: 2512; Min Operating Temperature: -55°C; Depth: 3.15mm; Max Operating Temperature: 155°C; Tolerance: 1%; Power Rating: 1W; Height: 0.6mm
U6 = CMP-0271-00131-3: as U14 on sheet ADC_Core; PackageDescription: 8-Pin Plastic Small Outline, Body 4.9 x 3.9 mm, Pitch 1.27 mm; PackageReference: D0008A; ComponentLink3Description: Package Specification; ComponentLink3URL: http://www.ti.com/litv/pdf/msoi002j; DatasheetVersion: SBOS498A; Mounting Technology: Surface Mount; ComponentLink2Description: Datasheet; ComponentLink2URL: http://www.ti.com/lit/ds/symlink/opa140.pdf; ComponentLink1Description: Manufacturer URL; ComponentLink1URL: http://www.ti.com/; PackageVersion: 4040047-3/M, 06/2011; Code_JEDEC: MS-012; Eco-Plan: Green (RoHS & no Sb/Br); PartNumber: OPA140AID
U7 = CMP-0359-03002-2: Single Channel, Low Noise High Speed Operational Amplifier, 20 MHz Typical GBW, 6 V/us Typical SR, 8 to 44 V, 8-Pin SOIC (S8-8), Commercial, Pb-Free; Linear Technology Part Number: LT1128; Manufacturer: Linear Technology; Vos (mV) Typical: 0.01; Is (mA) Typical: 7.4; GBW (MHz) Typical: 20; Vs Min (V): 8; Channels (#): 1; SR (V/us) Typical: 6; Vs Max (V): 44; ComponentLink3Description: Package Specification; PartNumber: LT1128CS8#PBF; PackageDescription: 8-Pin Plastic Small Outline, Body 4.9 x 3.9 mm, Pitch 1.27 mm; ComponentLink1URL: http://www.linear.com/; ComponentLink2Description: Datasheet; RevisionNote: URLs updated; RoHS: Pb-Free; ComponentLink2URL: http://cds.linear.com/docs/en/datasheet/1028fb.pdf; PackageReference: LT-S8-8; ComponentLink3URL: http://cds.linear.com/docs/en/packaging/05081610_G_SO8.pdf; ComponentLink1Description: Manufacturer URL; DatasheetVersion: Rev. B; PackageVersion: Rev G; Mounting Technology: Surface Mount; Type: VFB
U8 = CMP-0023-00636-1: 30k 2 kV ESD Precision-Matched Resistor-Divider, -40 to 85 degC, 3-pin SOT (U3+2), Pb-Free, Tape and Reel; PartNumber: MAX5491LC01000+T; ComponentLink1Description: Manufacturer URL; PackageDescription: 3-Pin Small-Outline Transistor Package (U3+2), Body 2.92 x 1.3 mm, Pitch 0.95 mm; DatasheetVersion: Rev. 3; ComponentLink2URL: http://datasheets.maximintegrated.com/en/ds/MAX5491.pdf; Applications: Precision Voltage Divider; Mounting Technology: Surface Mount; Code_JEDEC: TO236; PackageVersion: Rev. J, 06/2012; PackageReference: U3+2; ComponentLink3URL: http://pdfserv.maximintegrated.com/package_dwgs/21-0051.PDF; ComponentLink2Description: Datasheet; ComponentLink3Description: Package Specification; ComponentLink1URL: http://www.maximintegrated.com/

## Sheet FPGA.SchDoc
size A2
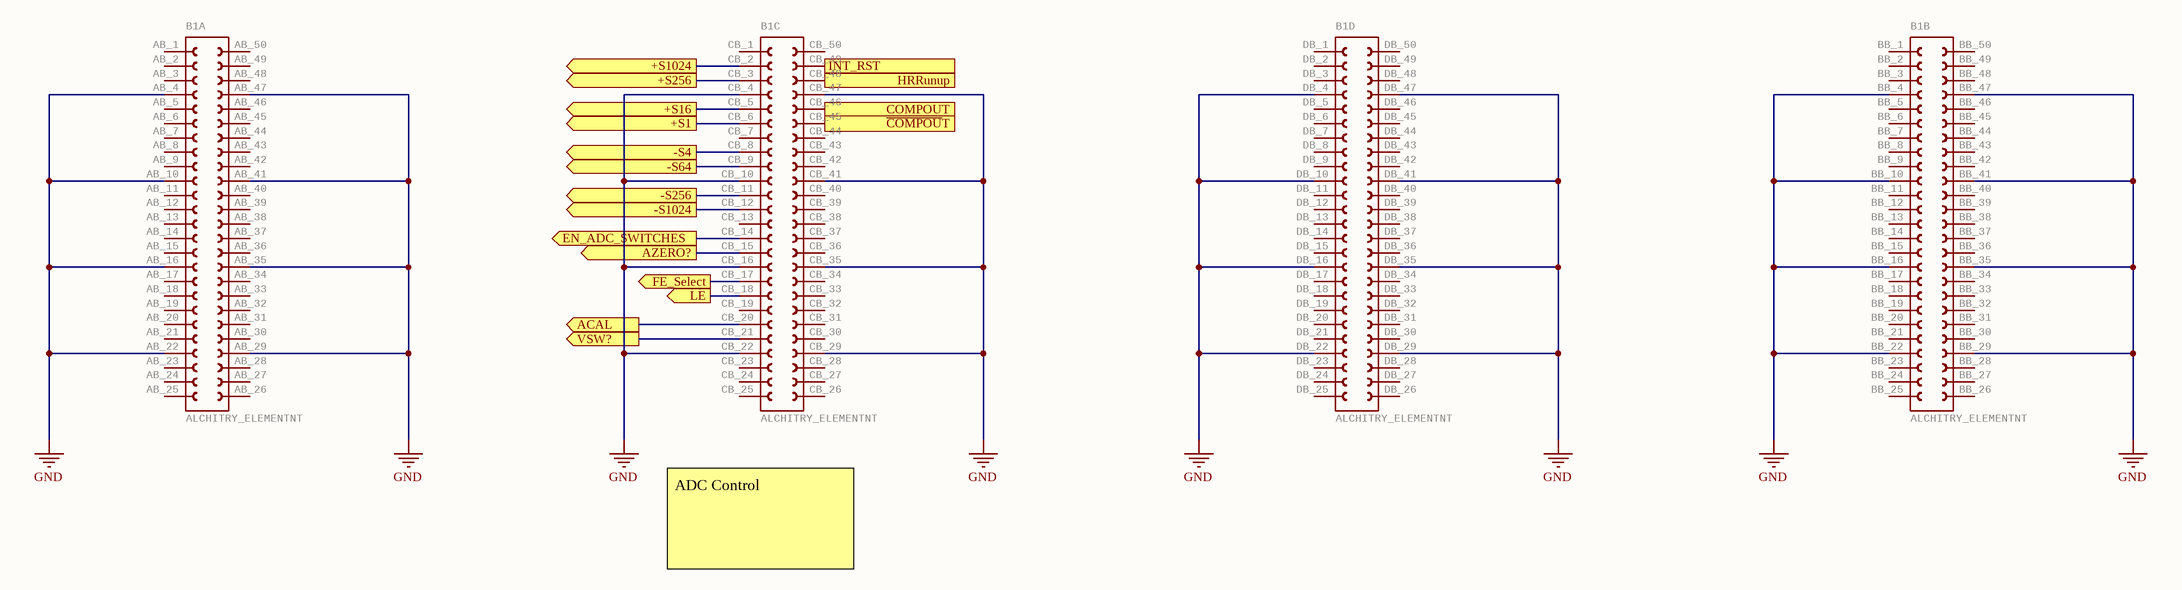
[diagram p4: FPGA.SchDoc]

### Parts
B1  ALCHITRY_ELEMENTNT  [ELEMENT_NO_TOP]  (parts A,B,C,D of 4)

### Ports
+S1 (out), +S16 (out), +S256 (out), +S1024 (out), -S4 (out), -S64 (out), -S256 (out), -S1024 (out), ACAL (out), AZERO? (out), COMPOUT (in), EN_ADC_SWITCHES (out), FE_Select (out), HRRunup (out), INT_RST (out), LE (out), VSW? (out), ~{COMPOU}T (in)

### Nets
GND: B1.AB_4 B1.AB_10 B1.AB_16 B1.AB_22 B1.AB_29 B1.AB_35 B1.AB_41 B1.AB_47 B1.BB_4 B1.BB_10 B1.BB_16 B1.BB_22 B1.BB_29 B1.BB_35 B1.BB_41 B1.BB_47 B1.CB_4 B1.CB_10 B1.CB_16 B1.CB_22 B1.CB_29 B1.CB_35 B1.CB_41 B1.CB_47 B1.DB_4 B1.DB_10 B1.DB_16 B1.DB_22 B1.DB_29 B1.DB_35 B1.DB_41 B1.DB_47
SW_ENABLE: B1.CB_14 ; port EN_ADC_SWITCHES
NetB1_CB_2: B1.CB_2 ; port +S1024
NetB1_CB_3: B1.CB_3 ; port +S256
NetB1_CB_5: B1.CB_5 ; port +S16
NetB1_CB_6: B1.CB_6 ; port +S1
NetB1_CB_8: B1.CB_8 ; port -S4
NetB1_CB_9: B1.CB_9 ; port -S64
NetB1_CB_11: B1.CB_11 ; port -S256
NetB1_CB_12: B1.CB_12 ; port -S1024
NetB1_CB_15: B1.CB_15 ; port AZERO?
NetB1_CB_17: B1.CB_17 ; port FE_Select
NetB1_CB_18: B1.CB_18 ; port LE
NetB1_CB_20: B1.CB_20 ; port ACAL
NetB1_CB_21: B1.CB_21 ; port VSW?
NetB1_CB_45: B1.CB_45 ; port ~{COMPOU}T
NetB1_CB_46: B1.CB_46 ; port COMPOUT
NetB1_CB_48: B1.CB_48 ; port HRRunup
NetB1_CB_49: B1.CB_49 ; port INT_RST

Not connected (* = marked no-connect by the designer): B1 AB_1(1) AB_2(2) AB_3(3) AB_5(5) AB_6(6) AB_7(7) AB_8(8) AB_9(9) AB_11(11) AB_12(12) AB_13(13) AB_14(14) AB_15(15) AB_17(17) AB_18(18) AB_19(19) AB_20(20) AB_21(21) AB_23(23) AB_24(24) AB_25(25) AB_26(26) AB_27(27) AB_28(28) AB_30(30) AB_31(31) AB_32(32) AB_33(33) AB_34(34) AB_36(36) AB_37(37) AB_38(38) AB_39(39) AB_40(40) AB_42(42) AB_43(43) AB_44(44) AB_45(45) AB_46(46) AB_48(48) AB_49(49) AB_50(50) BB_1(1) BB_2(2) BB_3(3) BB_5(5) BB_6(6) BB_7(7) BB_8(8) BB_9(9) BB_11(11) BB_12(12) BB_13(13) BB_14(14) BB_15(15) BB_17(17) BB_18(18) BB_19(19) BB_20(20) BB_21(21) BB_23(23) BB_24(24) BB_25(25) BB_26(26) BB_27(27) BB_28(28) BB_30(30) BB_31(31) BB_32(32) BB_33(33) BB_34(34) BB_36(36) BB_37(37) BB_38(38) BB_39(39) BB_40(40) BB_42(42) BB_43(43) BB_44(44) BB_45(45) BB_46(46) BB_48(48) BB_49(49) BB_50(50) CB_1(1) CB_7(7) CB_13(13) CB_19(19) CB_23(23) CB_24(24) CB_25(25) CB_26(26) CB_27(27) CB_28(28) CB_30(30) CB_31(31) CB_32(32) CB_33(33) CB_34(34) CB_36(36) CB_37(37) CB_38(38) CB_39(39) CB_40(40) CB_42(42) CB_43(43) CB_44(44) CB_50(50) DB_1(1) DB_2(2) DB_3(3) DB_5(5) DB_6(6) DB_7(7) DB_8(8) DB_9(9) DB_11(11) DB_12(12) DB_13(13) DB_14(14) DB_15(15) DB_17(17) DB_18(18) DB_19(19) DB_20(20) DB_21(21) DB_23(23) DB_24(24) DB_25(25) DB_26(26) DB_27(27) DB_28(28) DB_30(30) DB_31(31) DB_32(32) DB_33(33) DB_34(34) DB_36(36) DB_37(37) DB_38(38) DB_39(39) DB_40(40) DB_42(42) DB_43(43) DB_44(44) DB_45(45) DB_46(46) DB_48(48) DB_49(49) DB_50(50)

### Notes on the sheet
- ADC Control

### Library data of the parts
B1 = ALCHITRY_ELEMENTNT: GateName_1: A; SymbolName_1: FE25-2; GateName_2: B; GateName_3: C; GateName_4: D; DeviceName: NT; SymbolName_2: FE25-2; SymbolName_3: FE25-2; SymbolName_4: FE25-2; LibraryName: alchitry_elements; DeviceSetName: ALCHITRY_ELEMENT; Package: ELEMENT_NO_TOP